# EAGLE design pisniffer (EAGLE 9.3.2)
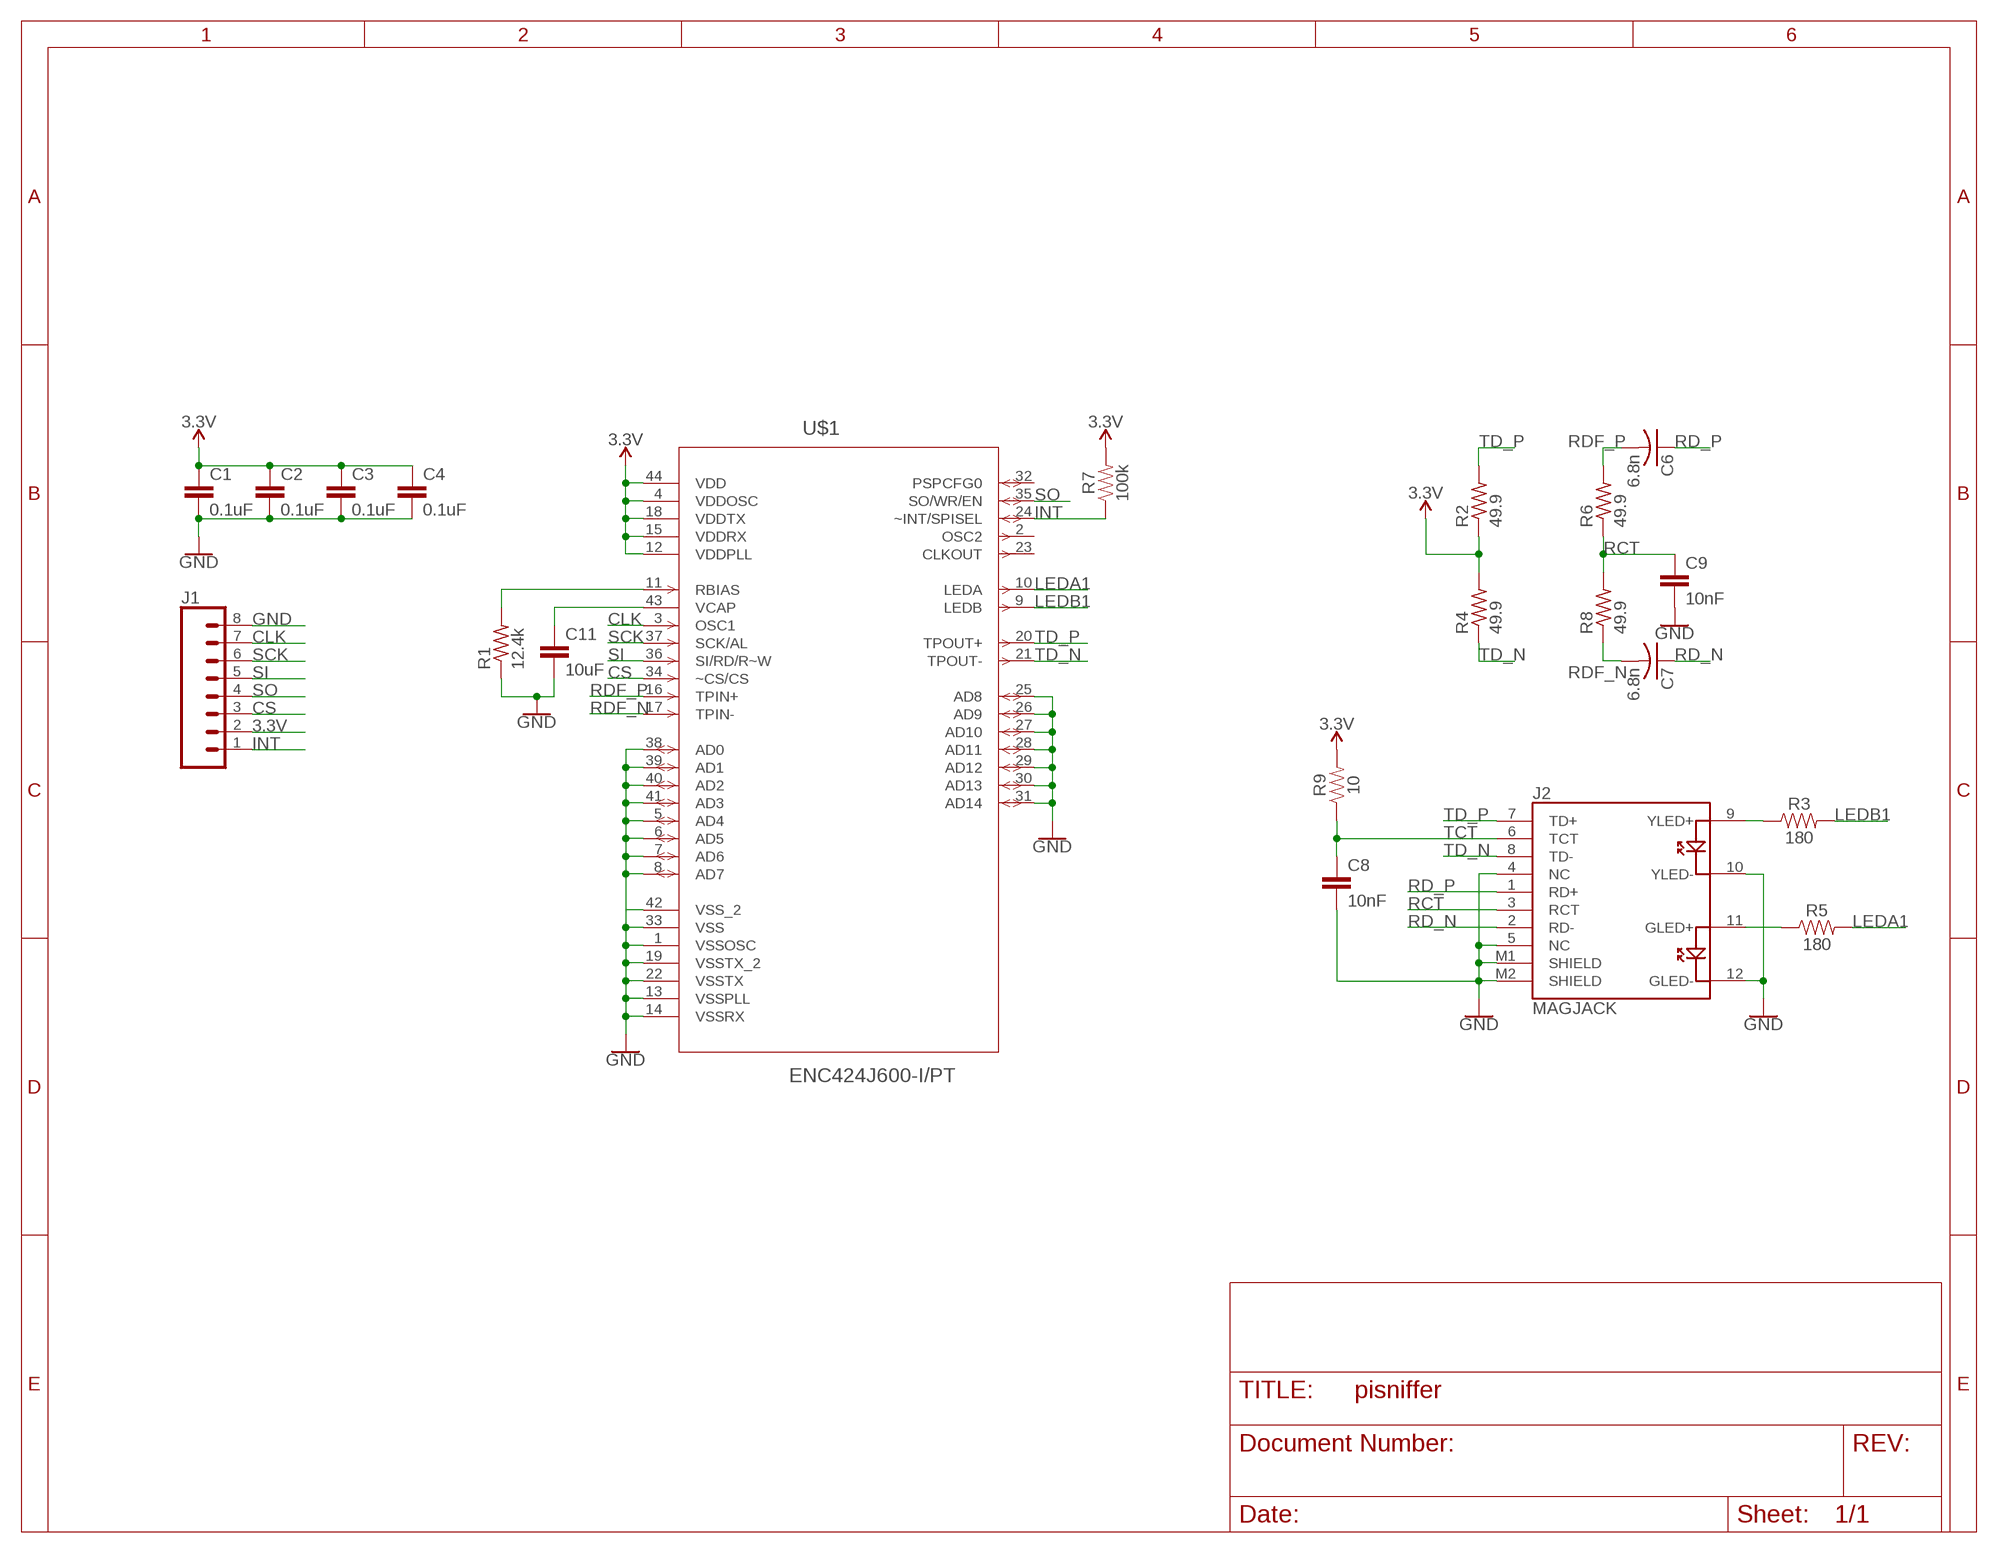
[diagram p0: schematic, sheet 1]

## Parts
C1  0.1uF  0.1UF-0603-25V-5%  [0603]
C2  0.1uF  0.1UF-0603-25V-5%  [0603]
C3  0.1uF  0.1UF-0603-25V-5%  [0603]
C4  0.1uF  0.1UF-0603-25V-5%  [0603]
C6  6.8n  C-USC0603  [C0603]
C7  6.8n  C-USC0603  [C0603]
C8  10nF  10NF-0603-50V-10%  [0603]
C9  10nF  10NF-0603-50V-10%  [0603]
C11  10uF  10UF-0603-6.3V-20%  [0603]
J1  CONN_08"  [1X08]
J2  MAGJACK  [MAGJACK]
R1  12.4k  R-US_R0603  [R0603]
R2  49.9  R-US_R0603  [R0603]
R3  180  180OHM-0603-1/10W-1%  [0603]
R4  49.9  R-US_R0603  [R0603]
R5  180  180OHM-0603-1/10W-1%  [0603]
R6  49.9  R-US_R0603  [R0603]
R7  100k  100KOHM-0603-1/10W-1%  [0603]
R8  49.9  R-US_R0603  [R0603]
R9  10  10OHM-0603-1/10W-1%  [0603]
U$1  ENC424J600-I/PT  [QFP50P1200X1200X120-44N]

## Nets
3.3V: C1.1 C2.1 C3.1 C4.1 J1.2 R2.1 R4.2 R7.2 R9.2 U$1.4(VDDOSC) U$1.12(VDDPLL) U$1.15(VDDRX) U$1.18(VDDTX) U$1.44(VDD)
CLK: J1.7 U$1.3(OSC1)
CS: J1.3 U$1.34(~CS/CS)
GND: C1.2 C2.2 C3.2 C4.2 C8.2 C9.2 C11.2 J1.8 J2.4(NC) J2.5(NC) J2.10(YLED-) J2.12(GLED-) J2.M1(SHIELD) J2.M2(SHIELD) R1.1 U$1.1(VSSOSC) U$1.5(AD4) U$1.6(AD5) U$1.7(AD6) U$1.8(AD7) U$1.13(VSSPLL) U$1.14(VSSRX) U$1.19(VSSTX_2) U$1.22(VSSTX) U$1.25(AD8) U$1.26(AD9) U$1.27(AD10) U$1.28(AD11) U$1.29(AD12) U$1.30(AD13) U$1.31(AD14) U$1.33(VSS) U$1.38(AD0) U$1.39(AD1) U$1.40(AD2) U$1.41(AD3) U$1.42(VSS_2)
INT: J1.1 R7.1 U$1.24(~INT/SPISEL)
LEDA1: R5.2 U$1.10(LEDA)
LEDB1: R3.2 U$1.9(LEDB)
N$1: C11.1 U$1.43(VCAP)
N$4: R1.2 U$1.11(RBIAS)
N$5: J2.9(YLED+) R3.1
N$6: J2.11(GLED+) R5.1
RCT: C9.1 J2.3(RCT) R6.1 R8.2
RD_N [ethernet]: C7.1 J2.2(RD-)
RD_P [ethernet]: C6.1 J2.1(RD+)
RDF_N [ethernet]: C7.2 R8.1 U$1.17(TPIN-)
RDF_P [ethernet]: C6.2 R6.2 U$1.16(TPIN+)
SCK: J1.6 U$1.37(SCK/AL)
SI: J1.5 U$1.36(SI/RD/R~W)
SO: J1.4 U$1.35(SO/WR/EN)
TCT: C8.1 J2.6(TCT) R9.1
TD_N [ethernet]: J2.8(TD-) R4.1 U$1.21(TPOUT-)
TD_P [ethernet]: J2.7(TD+) R2.2 U$1.20(TPOUT+)
Unconnected: U$1.2(OSC2) U$1.23(CLKOUT) U$1.32(PSPCFG0)

## Library data of the parts
C1-C4 = SparkFun-Capacitors:0.1UF: 0.1µF ceramic capacitors A capacitor is a passive two-terminal electrical component used to store electrical energy temporarily in an electric field.; PROD_ID: CAP-08604
C6 C7 = rcl:C-US: CAPACITOR, American symbol; SPICEPREFIX: C
C8 C9 = SparkFun-Capacitors:10NF: 0.01uF/10nF/10,000pF ceramic capacitors A capacitor is a passive two-terminal electrical component used to store electrical energy temporarily in an electric field. CAP-09321; PROD_ID: CAP-00867
C11 = SparkFun-Capacitors:10UF: 10.0µF ceramic capacitors A capacitor is a passive two-terminal electrical component used to store electrical energy temporarily in an electric field.; PROD_ID: CAP-11015
J1 = SparkFun-Connectors:CONN_08: Multi connection point. Often used as Generic Header-pin footprint for 0.1 inch spaced/style header connections On any of the 0.1 inch spaced packages, you can populate with these: Break Away Headers - Straight <https://www.sparkfun.com/products/116> (PRT-00116) Break Away Male Headers - Right Angle <https://www.sparkfun.com/products/553> (PRT-00553) Female Headers <https://www.sparkfun.com/products/115> (PRT-00115) Break Away Headers - Machine Pin <https://www.sparkfun.com/products/117> (PRT-00117) Break Away Female Headers - Swiss Machine Pin <https://www.sparkfun.com/products/743> (PRT-00743) Arduino Stackable Header - 8 Pin <https://www.sparkfun.com/products/9279> (PRT-09279) For SCREWTERMINALS and SPRING TERMINALS visit here: Screw Terimnals on SparkFun.com <https://www.sparkfun.com/search/results?term=Screw+Terminals> (5mm/3.5mm/2.54mm spacing) This device is also useful as a general connection point to wire up your design to another part of your project. Our various solder wires solder well into these plated through hole pads. Hook-Up Wire - Assortment (Stranded, 22 AWG) <https://www.sparkfun.com/products/11375> (PRT-11375) Hook-Up Wire - Assortment (Solid Core, 22 AWG) <https://www.sparkfun.com/products/11367> (PRT-11367) View the entire wire category on our website here <https://www.sparkfun.com/categories/141> Special notes: Molex polarized connector foot print use with SKU : PRT-08231 with associated crimp pins and housings. 1MM SMD Version SKU: PRT-10208 NOTES ON THE VARIANTS LOCK and LOCK_LONGPADS... This footprint was designed to help hold the alignment of a through-hole component (i.e. 6-pin header) while soldering it into place. You may notice that each hole has been shifted either up or down by 0.005 of an inch from it's more standard position (which is a perfectly straight line). This slight alteration caused the pins (the squares in the middle) to touch the edges of the holes. Because they are alternating, it causes a "brace" to hold the component in place. 0.005 has proven to be the perfect amount of "off-center" position when using our standard breakaway headers. Although looks a little odd when you look at the bare footprint, once you have a header in there, the alteration is very hard to notice. Also,if you push a header all the way into place, it is covered up entirely on the bottom side.; PROD_ID: CONN-08438
J2 = SparkFun-Connectors:MAGJACK: MAGJACK: RJ-45 with LEDs This is a single port, RJ45 ethernet jacks with built in transformer (magnetics), status LEDs, and shielding. Here is the connector we sell at SparkFun: RJ45 Ethernet MagJack-Compatible <https://www.sparkfun.com/products/8534> (PRT-08534) Datasheet <http://www.sparkfun.com/datasheets/Prototyping/MagJack.pdf> It is used on this SparkFun product: SparkFun RJ45 MagJack Breakout <https://www.sparkfun.com/products/13021> (BOB-13021); PROD_ID: CONN-09556; SF_ID: PRT-08534
R1 R2 R4 R6 R8 = rcl:R-US_: RESISTOR, American symbol; SPICEPREFIX: R
R3 R5 = SparkFun-Resistors:180OHM: 180Ω resistor A resistor is a passive two-terminal electrical component that implements electrical resistance as a circuit element. Resistors act to reduce current flow, and, at the same time, act to lower voltage levels within circuits. - Wikipedia; PROD_ID: RES-08788
R7 = SparkFun-Resistors:100KOHM: 100kΩ resistor A resistor is a passive two-terminal electrical component that implements electrical resistance as a circuit element. Resistors act to reduce current flow, and, at the same time, act to lower voltage levels within circuits. - Wikipedia; PROD_ID: RES-07828
R9 = SparkFun-Resistors:10OHM: 10Ω resistor A resistor is a passive two-terminal electrical component that implements electrical resistance as a circuit element. Resistors act to reduce current flow, and, at the same time, act to lower voltage levels within circuits. - Wikipedia; PROD_ID: RES-12581
U$1 = ENC424J600:ENC424J600-I/PT: Stand-Alone 10/100 Ethernet Controller; DESCRIPTION: Stand-Alone 10/100 Ethernet Controller; MPN: enc424j600-I/pt; OC_FARNELL: 1740226; OC_NEWARK: 07P9120; PACKAGE: TQFP-44; SUPPLIER: Microchip

## Net classes
0 default: width 0.254 mm
1 ethernet: width 0.305 mm

## Board
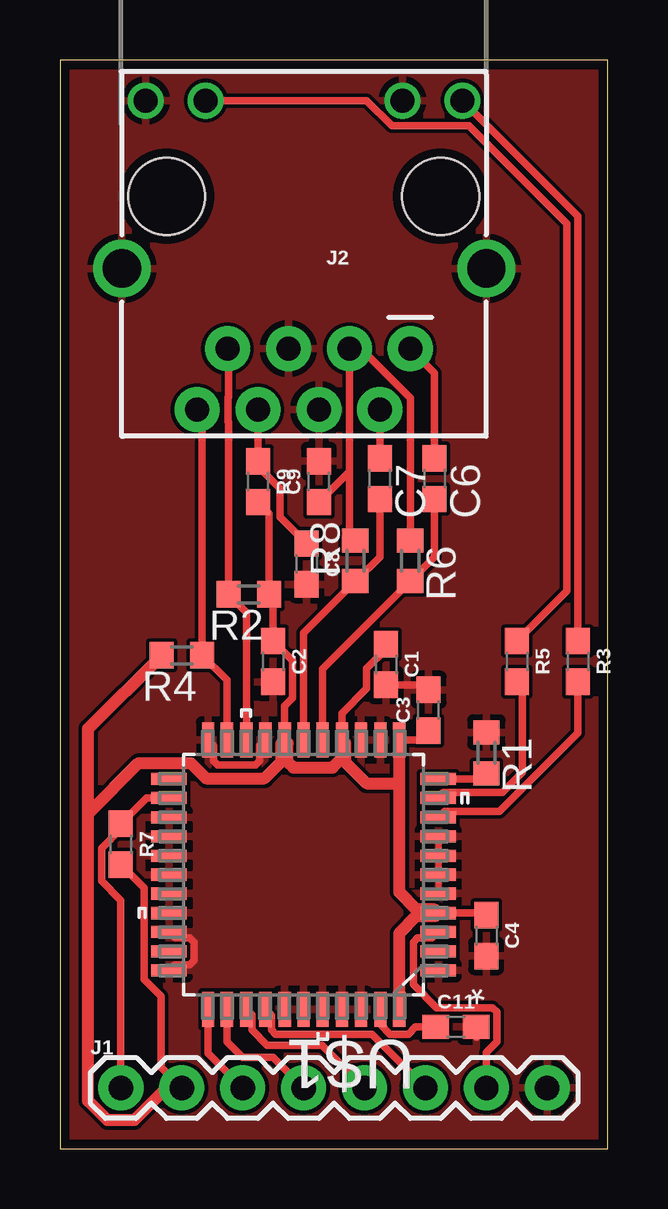
[diagram p1: board, top side]
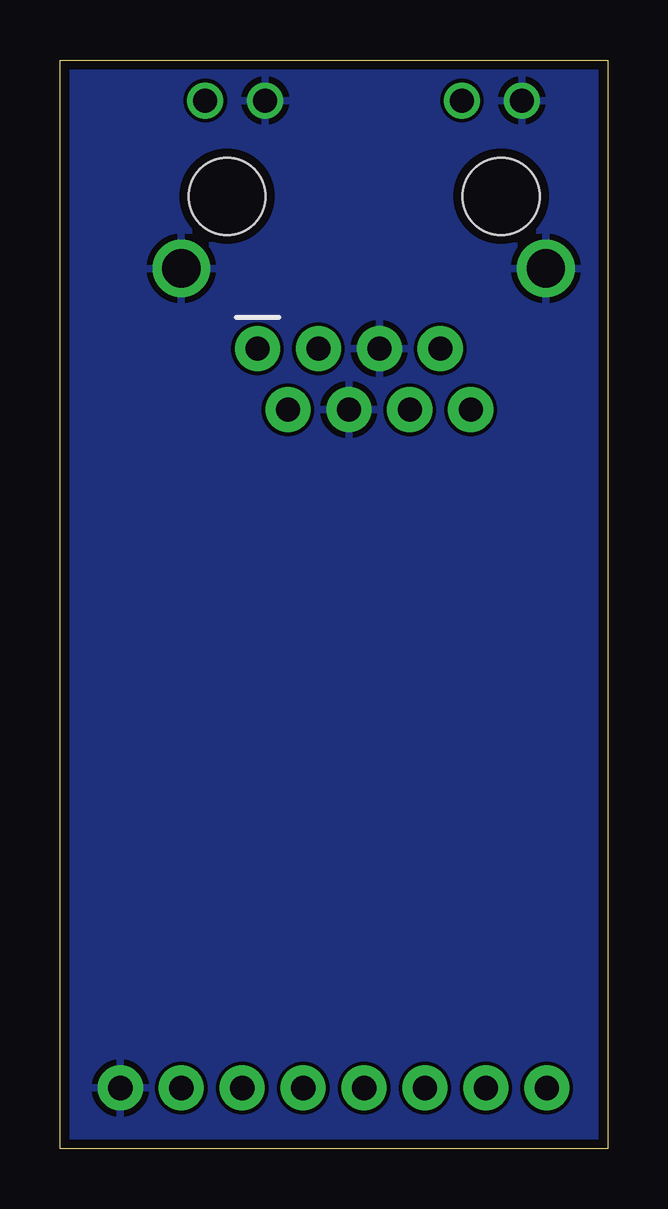
[diagram p2: board, bottom side, seen from below]

Size 22.84 x 45.39 mm. Coordinates in mm from the lower left corner, seen from the top.
Outline: 0,0 22.84,0 22.84,45.39 0,45.39 0,0
Copper layers (1*16): Top 0.035559375mm / dielectric 1.6mm / Bottom 0.035559375mm
Design rules "oshpark-2layer": minimum track width 6mil, minimum drill 10mil, track to track 6mil, track to pad 6mil, pad to pad 6mil, via to via 6mil, smd to smd 6mil, copper to edge 15mil, drill to drill 6mil, minimum pad ring 5mil, minimum via ring 5mil, stop-mask expansion 2.5mil, vias tented up to drill 0mil, thermal gap 10mil

### Footprints (pad centres in the part's own frame; a part is rotated, then mirrored left to right if it is on the bottom)
0603 = smd 1.1 x 1: 1 -0.85,0; 2 0.85,0
C0603 = smd 1.1 x 1: 1 -0.85,0; 2 0.85,0
1X08 = drill 1.016 pad 1.88: 1 0,0; 2 2.54,0; 3 5.08,0; 4 7.62,0; 5 10.16,0; 6 12.7,0; 7 15.24,0; 8 17.78,0
MAGJACK = drill 1 pad 1.88: 1 3.175,17.445; 2 4.445,19.985; 3 5.715,17.445; 4 6.985,19.985; 5 8.255,17.445; 6 9.525,19.985; 7 10.795,17.445; 8 12.065,19.985 | drill 1 pad 1.27: 9 1,7.1; 10 3.5,7.1; 11 11.7,7.1; 12 14.2,7.1 | drill 1.6 pad 2.184: M1 0,14.1; M2 15.2,14.1 | hole 3.2: 1.905,11.095; 13.335,11.095
R0603 = smd 1 x 1.1: 1 -0.85,0; 2 0.85,0
QFP50P1200X1200X120-44N = smd 1.473 x 0.508: 1 -5.613,3.988; 2 -5.613,3.2; 3 -5.613,2.388; 4 -5.613,1.6; 5 -5.613,0.787; 6 -5.613,0; 7 -5.613,-0.787; 8 -5.613,-1.6; 9 -5.613,-2.388; 10 -5.613,-3.2; 11 -5.613,-3.988; 23 5.613,-3.988; 24 5.613,-3.2; 25 5.613,-2.388; 26 5.613,-1.6; 27 5.613,-0.787; 28 5.613,0; 29 5.613,0.787; 30 5.613,1.6; 31 5.613,2.388; 32 5.613,3.2; 33 5.613,3.988 | smd 0.508 x 1.473: 12 -3.988,-5.613; 13 -3.2,-5.613; 14 -2.388,-5.613; 15 -1.6,-5.613; 16 -0.787,-5.613; 17 0,-5.613; 18 0.787,-5.613; 19 1.6,-5.613; 20 2.388,-5.613; 21 3.2,-5.613; 22 3.988,-5.613; 34 3.988,5.613; 35 3.2,5.613; 36 2.388,5.613; 37 1.6,5.613; 38 0.787,5.613; 39 0,5.613; 40 -0.787,5.613; 41 -1.6,5.613; 42 -2.388,5.613; 43 -3.2,5.613; 44 -3.988,5.613

### Placement (x,y rotation side)
C1  13.59,20.19 270 top
C2  8.89,20.32 270 top
C3  15.37,18.29 90 top
C4  17.78,8.89 270 top
C6  15.62,27.94 270 top
C7  13.34,27.94 270 top
C8  10.29,24.38 270 top
C9  10.79,27.81 90 top
C11  16.51,5.08 0 top
J1  2.54,2.54 0 top
J2  17.78,50.8 180 top
R1  17.78,16.51 270 top
R2  7.87,23.11 180 top
R3  21.59,20.32 270 top
R4  5.08,20.57 180 top
R5  19.05,20.32 270 top
R6  14.61,24.51 270 top
R7  2.54,12.7 270 top
R8  12.32,24.51 90 top
R9  8.26,27.81 270 top
U$1  10.16,11.43 180 top

### Tracks (layer width: path | path; a pad name or v marks a point on that pad's centre or on a via)
3.3V
  Top 0.305: R7.2 3.5,10.88 3.5,7.06 4.22,6.35 4.22,3.4 J1.2 | U$1.4 17.69,9.83 C4.1 | U$1.18 9.37,18.47 9.7,18.79 9.7,20.36 C2.1 8.89,22.95 R2.1 8.72,26.49 R9.2 | U$1.12 14.97,17.04 C3.1 | U$1.15 11.76,18.16 12.78,19.18 12.78,20.02 13.59,20.82 C1.1
  Top 0.508: J1.2 4.44,2.54 3.1,1.19 1.98,1.19 1.18,2 1.18,13.97 | R4.2 1.18,17.52 1.18,13.97 | U$1.44 14.15,8.98 14.87,9.7 15.65,9.7 U$1.4 15.62,9.98 14.87,9.98 14.15,10.7 14.15,15.24 | 14.15,15.24 U$1.12 | 14.15,15.24 12.79,15.24 11.89,16.14 11.89,16.92 U$1.15 11.76,16.29 11.37,15.9 9.74,15.9 9.5,16.14 9.5,16.92 U$1.18 9.22,16.89 9.22,16.14 8.53,15.44 6.09,15.44 5.45,16.08 3.29,16.08 1.18,13.97
CLK
  Top 0.305: J1.7 17.78,4.02 18.21,4.45 18.21,5.71 18.04,5.88 15.71,5.88 14.73,6.86 14.73,8.61 14.91,8.79 15.52,8.79 U$1.3
CS
  Top 0.305: U$1.34 6.17,3.99 J1.3
GND
  Top 0.254: U$1.8 U$1.7 U$1.6 U$1.5
  Top 0.305: C11.2 17.36,4.66 | C1.2 15.16,19.34 C3.2 | U$1.31 4.8,8.79 5.41,8.79 5.59,8.61 5.59,7.85 5.41,7.67 4.78,7.67 U$1.33 | U$1.22 6.4,16.82 6.4,16.18 6.58,16 8.15,16 8.33,16.18 8.33,16.82 U$1.19
  pour Bottom: 0,0 22.86,0 22.86,45.72 0,45.72
  pour Top: 0,0 22.86,0 22.86,45.72 0,45.72
INT
  Top 0.305: J1.1 2.54,10.37 1.74,11.17 1.74,12.53 2.54,13.33 R7.1 3.62,14.63 U$1.24
LEDA1
  Top 0.305: U$1.10 16,14.86 18.46,14.86 19.29,15.68 19.29,19.23 R5.2
LEDB1
  Top 0.305: U$1.9 16.03,14.07 18.32,14.07 21.59,17.34 R3.2
N$1
  Top 0.305: C11.1 14.83,5.08 14.53,4.78 13.77,4.78 13.36,5.18 U$1.43
N$4
  Top 0.305: U$1.11 17.54,15.42 R1.2
N$5
  Top 0.305: R3.1 21.59,38.89 J2.9
N$6
  Top 0.305: J2.11 12.79,43.7 13.84,42.65 17.05,42.65 21.13,38.56 21.13,23.25 R5.1
RCT
  Top 0.305: C9.1 12.06,28.23 | 12.06,28.23 J2.3 12.55,33.35 14.61,31.3 R6.1 | R8.2 12.06,25.61 12.06,28.23
RD_N
  Top 0.305: C7.1 J2.2
RD_P
  Top 0.305: C6.1 15.62,32.34 J2.1
RDF_N
  Top 0.305: U$1.17 10.16,21.5 R8.1 13.34,24.68 C7.2
RDF_P
  Top 0.305: C6.2 15.62,24.68 R6.2 10.95,20 U$1.16
SCK
  Top 0.305: U$1.37 8.81,5.56 8.81,4.95 8.99,4.78 13.01,4.78 J1.6
SI
  Top 0.305: U$1.36 8,5.59 8,4.95 8.64,4.32 10.92,4.32 J1.5
SO
  Top 0.305: J1.4 8.89,3.81 7.62,3.81 6.96,4.47 U$1.35
TCT
  Top 0.305: J2.6 R9.1 8.26,28.44 9.18,27.52 9.18,26.34 C8.1
TD_N
  Top 0.305: U$1.21 6.96,19.54 R4.1 5.93,30.6 J2.8
TD_P
  Top 0.305: U$1.20 7.77,22.37 R2.2 7.02,30.29 7.01,30.3 7.01,31.33 7.02,31.34 7.02,33.32 J2.7